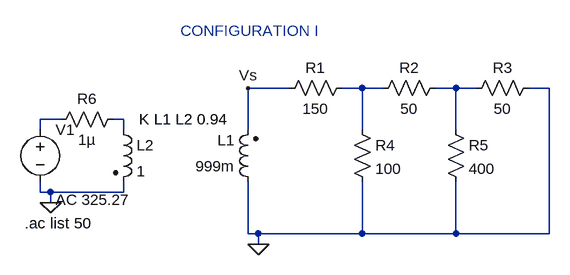
[diagram p0: schematic EXP1_PART2_CIRCUITO1.asc]
EXP1_PART2_CIRCUITO1.asc, the LTspice schematic file:
Version 4
SHEET 1 880 680
WIRE 176 80 112 80
WIRE 288 80 256 80
WIRE 320 80 288 80
WIRE 432 80 400 80
WIRE 464 80 432 80
WIRE 576 80 544 80
WIRE -176 128 -208 128
WIRE -80 128 -96 128
WIRE -208 144 -208 128
WIRE -80 144 -80 128
WIRE 112 144 112 80
WIRE 288 144 288 80
WIRE 432 144 432 80
WIRE -208 240 -208 224
WIRE -192 240 -208 240
WIRE -80 240 -80 224
WIRE -80 240 -192 240
WIRE -192 256 -192 240
WIRE 112 304 112 224
WIRE 128 304 112 304
WIRE 288 304 288 224
WIRE 288 304 128 304
WIRE 432 304 432 224
WIRE 432 304 288 304
WIRE 576 304 576 80
WIRE 576 304 432 304
WIRE 128 320 128 304
FLAG 128 320 0
FLAG 112 80 Vs
FLAG -192 256 0
SYMBOL res 272 64 R90
WINDOW 0 0 56 VBottom 2
WINDOW 3 32 56 VTop 2
SYMATTR InstName R1
SYMATTR Value 150
SYMBOL res 416 64 R90
WINDOW 0 0 56 VBottom 2
WINDOW 3 32 56 VTop 2
SYMATTR InstName R2
SYMATTR Value 50
SYMBOL res 560 64 R90
WINDOW 0 0 56 VBottom 2
WINDOW 3 32 56 VTop 2
SYMATTR InstName R3
SYMATTR Value 50
SYMBOL res 272 128 R0
SYMATTR InstName R4
SYMATTR Value 100
SYMBOL res 416 128 R0
SYMATTR InstName R5
SYMATTR Value 400
SYMBOL ind2 128 240 R180
WINDOW 0 36 80 Left 2
WINDOW 3 36 40 Left 2
SYMATTR InstName L1
SYMATTR Value 999m
SYMATTR Type ind
SYMBOL ind2 -96 128 R0
SYMATTR InstName L2
SYMATTR Value 1
SYMATTR Type ind
SYMBOL voltage -208 128 R0
WINDOW 123 24 124 Left 2
WINDOW 39 0 0 Left 0
SYMATTR InstName V1
SYMATTR Value ""
SYMATTR Value2 AC 325.27
SYMBOL res -80 112 R90
WINDOW 0 0 56 VBottom 2
WINDOW 3 32 56 VTop 2
SYMATTR InstName R6
SYMATTR Value 1µ
TEXT -56 128 Left 2 !K L1 L2 0.94
TEXT -232 288 Left 2 !.ac list 50
TEXT 8 -8 Left 2 ;CONFIGURATION I

The netlist it stands for:
* EXP1_PART2_CIRCUITO1.asc
R1 N001 Vs 150
R2 N002 N001 50
R3 0 N002 50
R4 N001 0 100
R5 N002 0 400
L1 0 Vs 999m
L2 N004 0 1
V1 N003 0 AC 325.27
R6 N004 N003 1µ
K L1 L2 0.94
.ac list 50
* CONFIGURATION I
.backanno
.end